# EAGLE schematic CHIP_Shield (EAGLE 7.5.0)
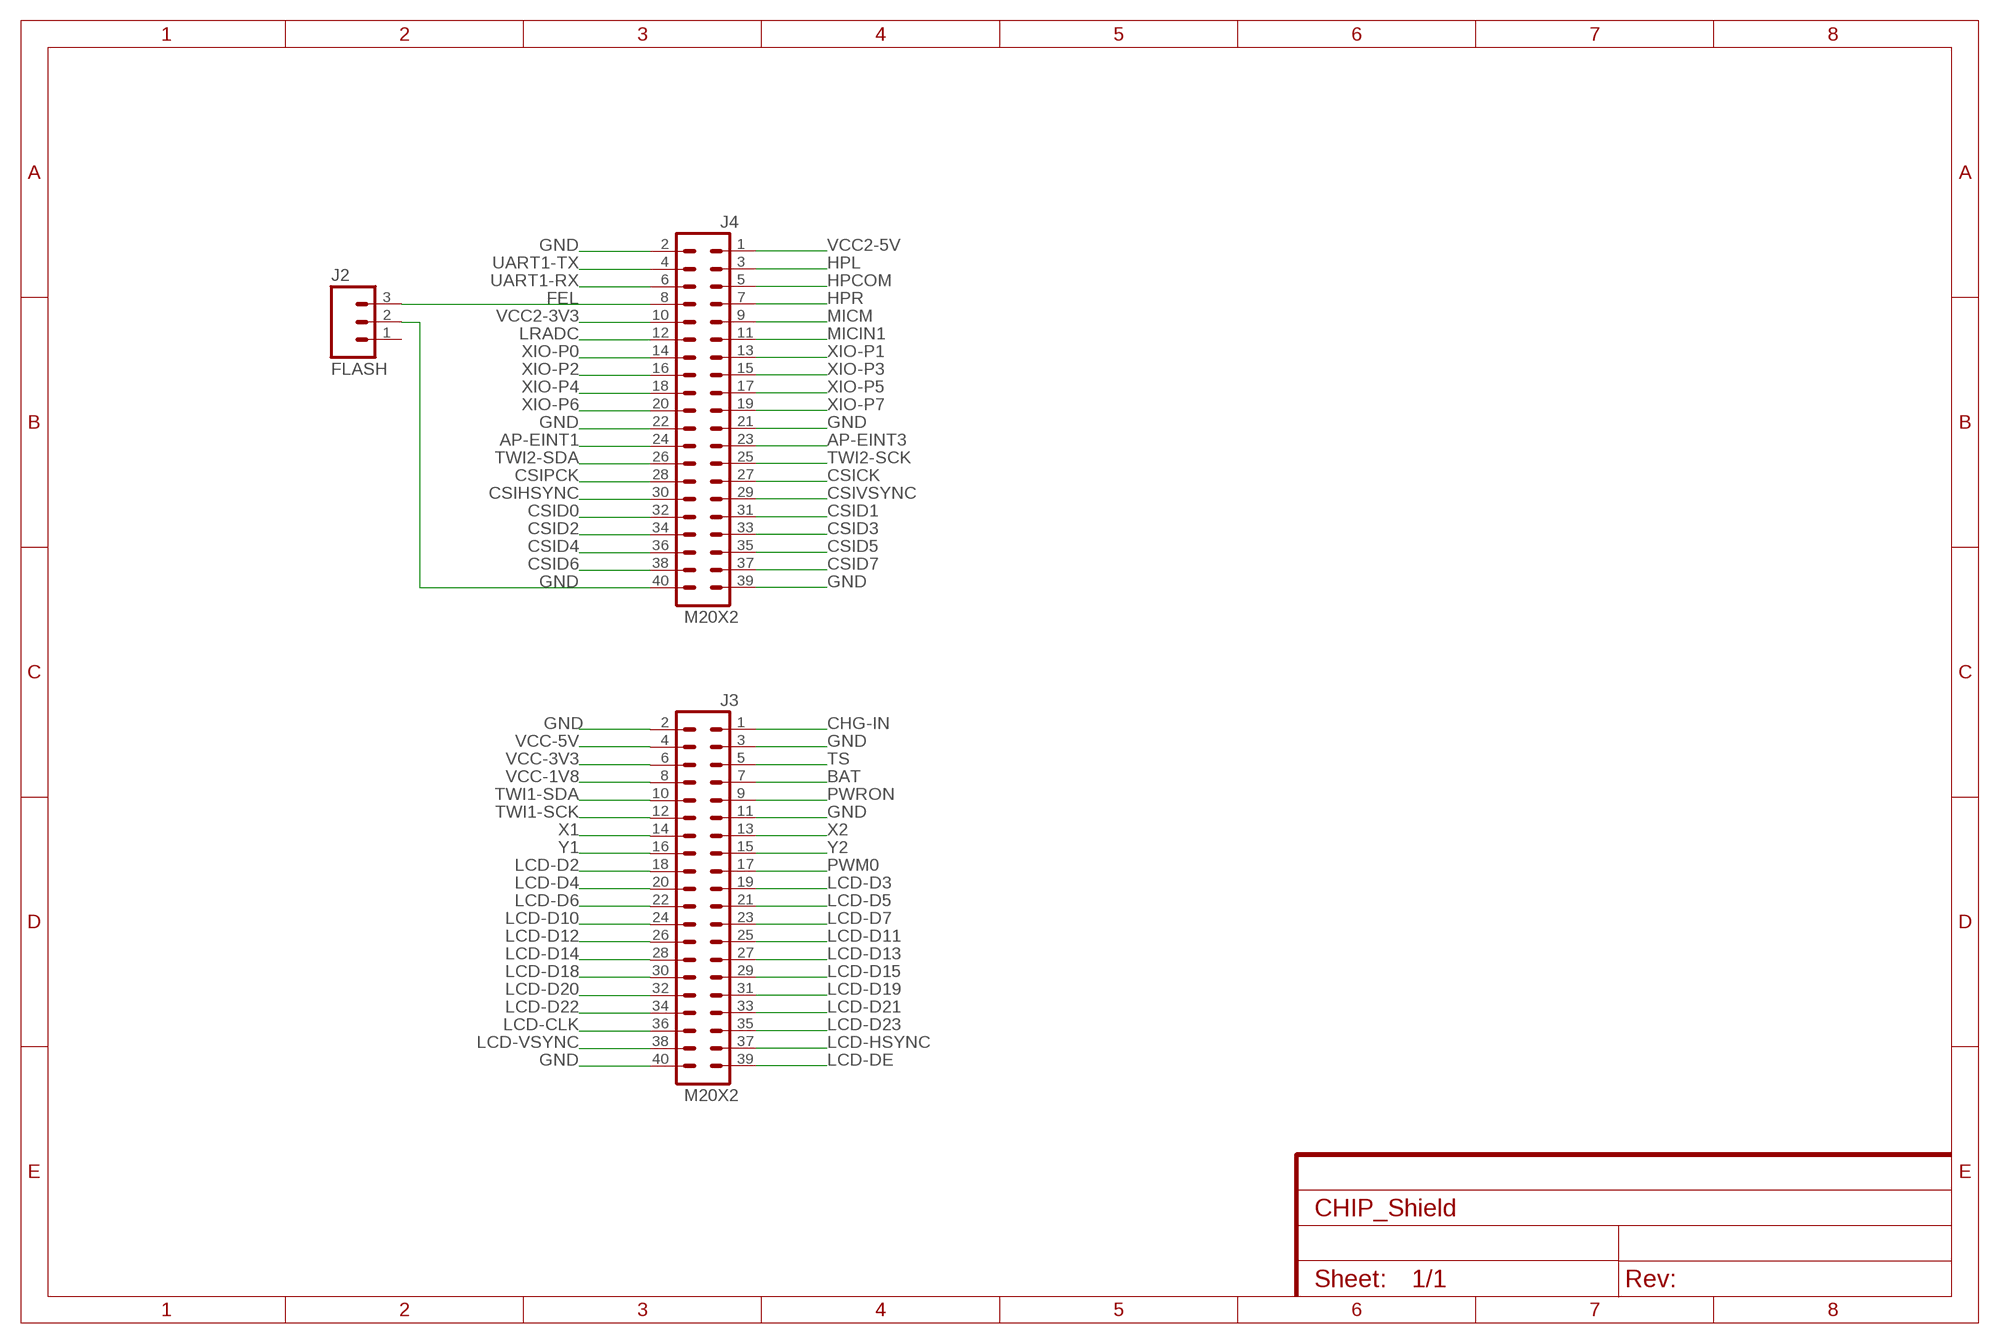
[diagram p0: schematic, sheet 1]

## Parts
J2  FLASH  M03PTH  [1X03]
J3  M20X2  [2X20]
J4  M20X2  [2X20]

## Nets
AP-EINT1: J4.24
AP-EINT3: J4.23
BAT: J3.7
CHG-IN: J3.1
CSICK: J4.27
CSID0: J4.32
CSID1: J4.31
CSID2: J4.34
CSID3: J4.33
CSID4: J4.36
CSID5: J4.35
CSID6: J4.38
CSID7: J4.37
CSIHSYNC: J4.30
CSIPCK: J4.28
CSIVSYNC: J4.29
FEL: J2.3 J4.8
GND: J2.2 J3.2 J3.3 J3.11 J3.40 J4.2 J4.21 J4.22 J4.39 J4.40
HPCOM: J4.5
HPL: J4.3
HPR: J4.7
LCD-CLK: J3.36
LCD-D2: J3.18
LCD-D3: J3.19
LCD-D4: J3.20
LCD-D5: J3.21
LCD-D6: J3.22
LCD-D7: J3.23
LCD-D10: J3.24
LCD-D11: J3.25
LCD-D12: J3.26
LCD-D13: J3.27
LCD-D14: J3.28
LCD-D15: J3.29
LCD-D18: J3.30
LCD-D19: J3.31
LCD-D20: J3.32
LCD-D21: J3.33
LCD-D22: J3.34
LCD-D23: J3.35
LCD-DE: J3.39
LCD-HSYNC: J3.37
LCD-VSYNC: J3.38
LRADC: J4.12
MICIN1: J4.11
MICM: J4.9
PWM0: J3.17
PWRON: J3.9
TS: J3.5
TWI1-SCK: J3.12
TWI1-SDA: J3.10
TWI2-SCK: J4.25
TWI2-SDA: J4.26
UART1-RX: J4.6
UART1-TX: J4.4
VCC2-3V3: J4.10
VCC2-5V: J4.1
VCC-1V8: J3.8
VCC-3V3: J3.6
VCC-5V: J3.4
X1: J3.14
X2: J3.13
XIO-P0: J4.14
XIO-P1: J4.13
XIO-P2: J4.16
XIO-P3: J4.15
XIO-P4: J4.18
XIO-P5: J4.17
XIO-P6: J4.20
XIO-P7: J4.19
Y1: J3.16
Y2: J3.15
Unconnected: J2.1

## Library data of the parts
J2 = SparkFun-Connectors:M03: Header 3 Standard 3-pin 0.1" header. Use with straight break away headers (SKU : PRT-00116), right angle break away headers (PRT-00553), swiss pins (PRT-00743), machine pins (PRT-00117), and female headers (PRT-00115). Molex polarized connector foot print use with SKU : PRT-08232 with associated crimp pins and housings.
J3 J4 = SparkFun-Connectors:M20X2: 0.1" spaced headers